# Altium project IR-sensor.PrjPcb
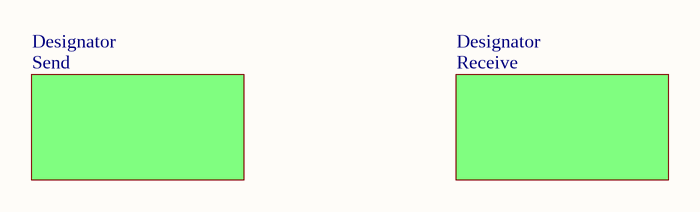
[diagram p0: main.SchDoc]
3 sheets, 38 parts. Net scope: global (net labels, ports and power ports of the same name join across sheets).
Board file: IR-sensor.PcbDoc
Sheets:
  main.SchDoc
    Designator = Send.SchDoc
    Designator = Receive.SchDoc

## Sheet main.SchDoc
size A; SheetNumber: 1; SheetTotal: 2

### Sub-sheets
Designator = Send: no entries
Designator = Receive: no entries

## Sheet Send.SchDoc
size A; SheetNumber: 3; SheetTotal: 3
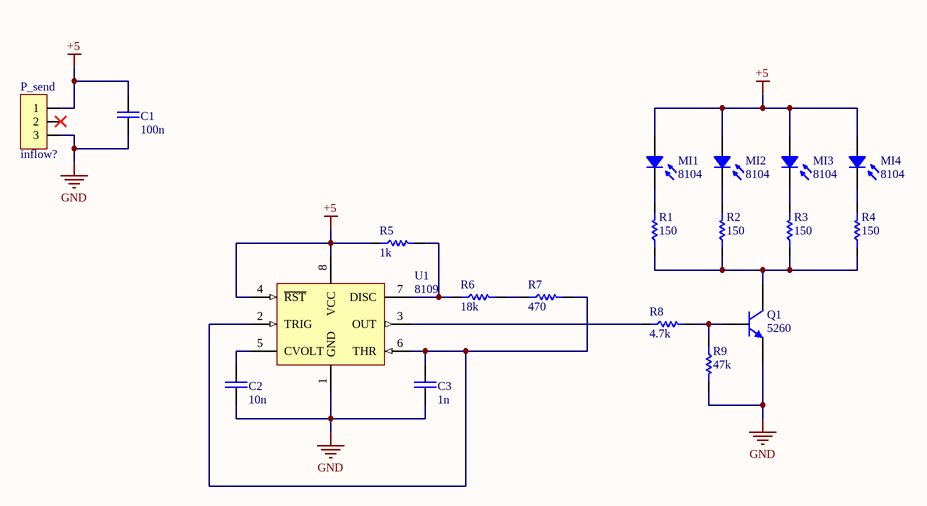
[diagram p1: Send.SchDoc]

### Parts
C1  100n  [CAP 1206/3216]
C2  10n  [CAP 1206/3216]
C3  1n  [CAP 1206/3216]
MI1  Inflow: 8104  [LED-5mm-IR Reciver]  (hidden comment: 5'mm)
MI2  Inflow: 8104  [LED-5mm-IR Reciver]  (hidden comment: 5'mm)
MI3  Inflow: 8104  [LED-5mm-IR Reciver]  (hidden comment: 5'mm)
MI4  Inflow: 8104  [LED-5mm-IR Reciver]  (hidden comment: 5'mm)
P_send  Inflow: inflow?  [MOLEX KK 0022272031]  (hidden comment: 3'Pin)
Q1  Inflow: 5260  [SOT23_N]  (hidden comment: NPN)
R1  150  [RES 1206 (3216X08L)]
R2  150  [RES 1206 (3216X08L)]
R3  150  [RES 1206 (3216X08L)]
R4  150  [RES 1206 (3216X08L)]
R5  1k  [RES 1206 (3216X08L)]
R6  18k  [RES 1206 (3216X08L)]
R7  470  [RES 1206 (3216X08L)]
R8  4.7k  [RES 1206 (3216X08L)]
R9  47k  [RES 1206 (3216X08L)]
U1  Inflow: 8109  [SO8_narrow_n]  (hidden comment: NE555)

### Nets
+5: C1.1 MI1.1 MI2.1 MI3.1 MI4.1 P_send.1 R5.1 U1.4(~{RST}) U1.8(VCC)
GND: C1.2 C2.2 C3.2 P_send.3 Q1.2(E) R9.2 U1.1(GND)
NetC2_1: C2.1 U1.5(CVOLT)
NetC3_1: C3.1 R7.2 U1.2(TRIG) U1.6(THR)
NetMI1_2: MI1.2 R1.2
NetMI2_2: MI2.2 R2.2
NetMI3_2: MI3.2 R3.2
NetMI4_2: MI4.2 R4.2
NetQ1_1: Q1.1(B) R8.2 R9.1
NetQ1_3: Q1.3(C) R1.1 R2.1 R3.1 R4.1
NetR5_2: R5.2 R6.1 U1.7(DISC)
NetR6_2: R6.2 R7.1
NetR8_1: R8.1 U1.3(OUT)

Not connected (* = marked no-connect by the designer): P_send 2*

### Library data of the parts
C1-C3 = Cap_Multi_SMD_1206: Bipolar ceramic capacitor SMD; Inflow: inflow?; Type: MultiLayer; Rating: Rating?; Validation: Valid; Package: 1206
  C1: Value: 100n
  C2: Value: 10n
  C3: Value: 1n
MI1-MI4 = ModSen_IR_Reciever: Infra Red Reciever Photo Diode; Rating: Rating?; Validation: NT; Value: 5'mm; Package: Package?; Type: Type?
P_send = Con_Signal_3: Signal Connector 3'Pin; Rating: Rating?; Validation: Valid; Value: 3'Pin; Package: Package?; Type: Type?
Q1 = Semi_BJT_2N2222_SMD: NPN Switching Transistors; Rating: Rating?; Type: Type?; Validation: Valid; Value: NPN; Package: Package?
R1-R9 = Res_SMD_1206: Resistor; Inflow: inflow?; Rating: 0.25W; Validation: Valid; Package: 1206; Type: 10%
  R1-R4: Value: 150
  R5: Value: 1k
  R6: Value: 18k
  R7: Value: 470
  R8: Value: 4.7k
  R9: Value: 47k
U1 = IC_TIM_NE555_SMD: Astable or monostable operation timer; Rating: Rating?; Validation: Valid; Value: NE555; Package: Package?; Type: Type?

## Sheet Receive.SchDoc
size A; SheetNumber: 2; SheetTotal: 3
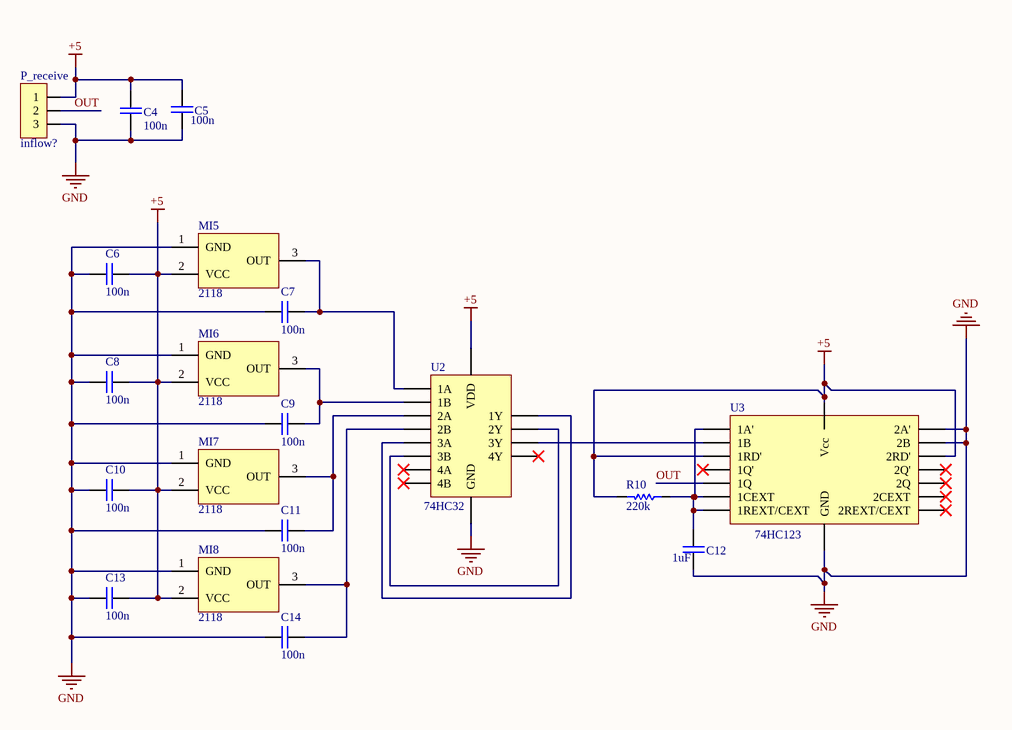
[diagram p2: Receive.SchDoc]

### Parts
C4  100n  [CAP 1206/3216]
C5  100n  [CAP 1206/3216]
C6  100n  [CAP 1206/3216]
C7  100n  [CAP 1206/3216]
C8  100n  [CAP 1206/3216]
C9  100n  [CAP 1206/3216]
C10  100n  [CAP 1206/3216]
C11  100n  [CAP 1206/3216]
C12  1uF  [CAP 1206/3216]
C13  100n  [CAP 1206/3216]
C14  100n  [CAP 1206/3216]
MI5  Inflow: 2118  [TSOP1238]  (hidden comment: TSOP1138)
MI6  Inflow: 2118  [TSOP1238]  (hidden comment: TSOP1138)
MI7  Inflow: 2118  [TSOP1238]  (hidden comment: TSOP1138)
MI8  Inflow: 2118  [TSOP1238]  (hidden comment: TSOP1138)
P_receive  Inflow: inflow?  [MOLEX KK 0022272031]  (hidden comment: 3'Pin)
R10  220k  [RES 1206 (3216X08L)]
U2  74HC32  [SOIC-14]
U3  74HC123  [SOIC-16]

### Nets
+5: C4.1 C5.1 C6.1 C8.1 C10.1 C13.1 MI5.2(VCC) MI6.2(VCC) MI7.2(VCC) MI8.2(VCC) P_receive.1 R10.2 U2.14(VDD) U3.2(1RD') U3.10(2RD') U3.15(Vcc)
GND: C4.2 C5.2 C6.2 C7.1 C8.2 C9.2 C10.2 C11.1 C12.2 C13.2 C14.1 MI5.1(GND) MI6.1(GND) MI7.1(GND) MI8.1(GND) P_receive.3 U2.7(GND) U3.7(GND) U3.8(2A') U3.9(2B)
OUT: P_receive.2 U3.12(1Q)
NetC7_2: C7.2 MI5.3(OUT) U2.1(1A)
NetC9_1: C9.1 MI6.3(OUT) U2.2(1B)
NetC11_2: C11.2 MI7.3(OUT) U2.4(2A)
NetC12_1: C12.1 R10.1 U3.0(1A') U3.13(1CEXT) U3.14(1REXT/CEXT)
NetC14_2: C14.2 MI8.3(OUT) U2.5(2B)
NetU2_3: U2.3(1Y) U2.9(3A)
NetU2_6: U2.6(2Y) U2.10(3B)
NetU2_8: U2.8(3Y) U3.1(1B)

Not connected (* = marked no-connect by the designer): U2 11(4Y)* 12(4A)* 13(4B)*; U3 3(1Q')* 4(2Q)* 5(2CEXT)* 6(2REXT/CEXT)* 11(2Q')*

### Library data of the parts
C4-C14 = Cap_Multi_SMD_1206: as C1 on sheet Send; Package: 1206
  C4-C11 C13 C14: Value: 100n
  C12: Value: 1uF
MI5-MI8 = ModSen_IR_TSOP1138: Reciver Remot Control (IR) 30-56KHz; Rating: Rating?; Validation: NT; Value: TSOP1138; Package: Package?; Type: Type?
P_receive = Con_Signal_3: as P_send on sheet Send; Value: 3'Pin; Package: Package?; Type: Type?
R10 = Res_SMD_1206: as R1 on sheet Send; Package: 1206; Type: 10%; Value: 220k
U2 = 74HC32: Quadruple 2-Input Positive OR Gate; value: 74HC32
U3 = 74HC123: Dual retriggerable monostable multivibrator with reset; value: 74HC123

## Nets that join several sheets
+5: Send (9 pins), Receive (16 pins)
GND: Send (7 pins), Receive (20 pins)